# Altium project RF_PCB_REV-B.PrjPcb
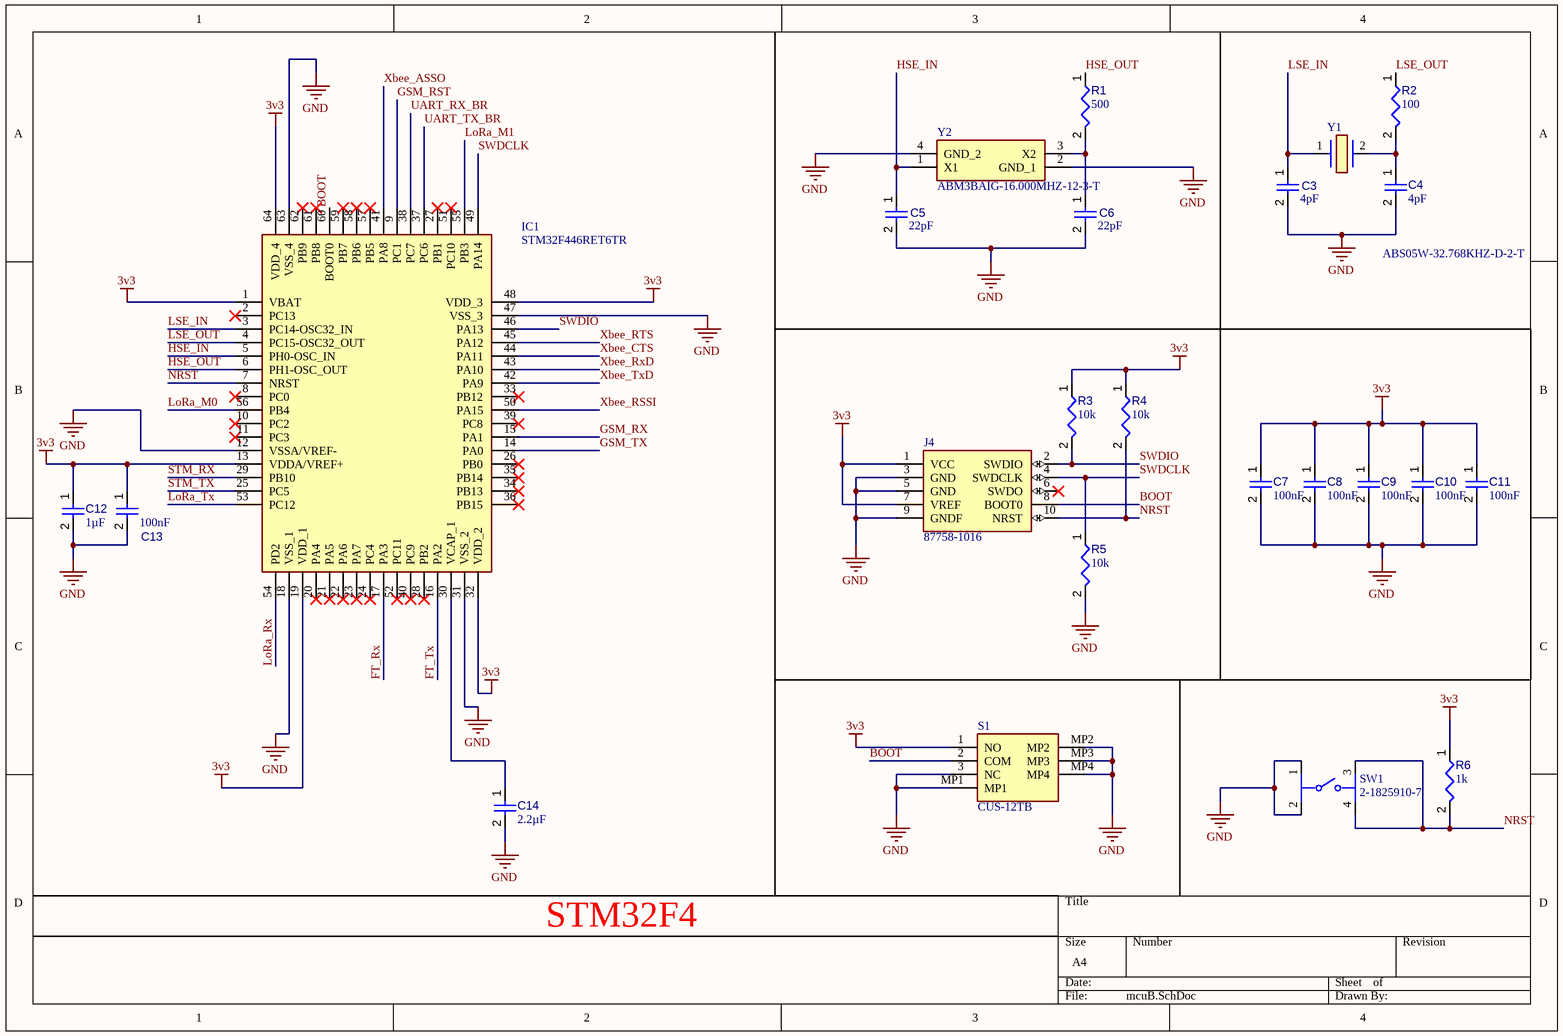
[diagram p0: mcuB.SchDoc]
3 sheets, 55 parts. Net scope: global (net labels, ports and power ports of the same name join across sheets).
Board file: RFPCB_REV-B.PcbDoc
Sheets:
  mcuB.SchDoc
  XbeeB.SchDoc
  LoRaB.SchDoc

## Sheet mcuB.SchDoc
size A4; SheetNumber: 1; SheetTotal: 3

### Parts
C3  value 4pF  [CAPC1608X90X40LL10T20]  (hidden comment: Capacitor 1 uF +/- 10% 25 V 0603)
C4  value 4pF  [CAPC1608X90X40LL10T20]  (hidden comment: Capacitor 1 uF +/- 10% 25 V 0603)
C5  value 22pF  [CAPC1608X90X40LL10T20]  (hidden comment: Capacitor 1 uF +/- 10% 25 V 0603)
C6  value 22pF  [CAPC1608X90X40LL10T20]  (hidden comment: Capacitor 1 uF +/- 10% 25 V 0603)
C7  value 100nF  [CAPC1608X90X40NL10T20]  (hidden comment: Capacitor 100 nF +/-10% 50 V 0603)
C8  value 100nF  [CAPC1608X90X40NL10T20]  (hidden comment: Capacitor 100 nF +/-10% 50 V 0603)
C9  value 100nF  [CAPC1608X90X40NL10T20]  (hidden comment: Capacitor 100 nF +/-10% 50 V 0603)
C10  value 100nF  [CAPC1608X90X40NL10T20]  (hidden comment: Capacitor 100 nF +/-10% 50 V 0603)
C11  value 100nF  [CAPC1608X90X40NL10T20]  (hidden comment: Capacitor 100 nF +/-10% 50 V 0603)
C12  value 1µF  [CAPC2013X135X45NL10T25]  (hidden comment: Capacitor 1 uF +/- 10% 50 V 0805)
C13  value 100nF  [CAPC1608X90X40NL10T20]  (hidden comment: Capacitor 100 nF +/-10% 50 V 0603)
C14  value 2.2µF  [CAPC2013X135X45NL10T25]  (hidden comment: Capacitor 1 uF +/- 10% 50 V 0805)
IC1  STM32F446RET6TR  [QFP50P1200X1200X160-64N]
J4  87758-1016  [HDRV10W75P200_2X5_990X400X595P]
R1  value 500  [RESC1608X55X25ML10T15]  (hidden comment: Resistor 10k +/-1% 0603 100 mW)
R2  value 100  [RESC1608X55X25ML10T15]  (hidden comment: Resistor 10k +/-1% 0603 100 mW)
R3  value 10k  [RESC1608X55X25ML10T15]  (hidden comment: Resistor 10k +/-1% 0603 100 mW)
R4  value 10k  [RESC1608X55X25ML10T15]  (hidden comment: Resistor 10k +/-1% 0603 100 mW)
R5  value 10k  [RESC1608X55X25ML10T15]  (hidden comment: Resistor 10k +/-1% 0603 100 mW)
R6  value 1k  [RESC1608X55X25ML10T15]  (hidden comment: Resistor 10k +/-1% 0603 100 mW)
S1  CUS-12TB  [CUS12TB]
SW1  2-1825910-7  [FP-2-1825910-7-MFG]
Y1  ABS05W-32.768KHZ-D-2-T  [ABS05W32768KHZD2T]
Y2  ABM3BAIG-16.000MHZ-12-3-T  [ABM3BAIG]

### Nets
3v3: C7.1 C8.1 C9.1 C10.1 C11.1 C12.1 C13.1 IC1.1(VBAT) IC1.13(VDDA/VREF+) IC1.19(VDD_1) IC1.32(VDD_2) IC1.48(VDD_3) IC1.64(VDD_4) J4.1(VCC) J4.7(VREF) R3.1 R4.1 R6.1 S1.1(NO)
GND: C3.2 C4.2 C5.2 C6.2 C7.2 C8.2 C9.2 C10.2 C11.2 C12.2 C13.2 C14.2 IC1.12(VSSA/VREF-) IC1.18(VSS_1) IC1.31(VSS_2) IC1.47(VSS_3) IC1.63(VSS_4) J4.3(GND) J4.5(GND) J4.9(GNDF) R5.2 S1.3(NC) S1.MP1 S1.MP2 S1.MP3 S1.MP4 SW1.1 SW1.2 Y2.2(GND_1) Y2.4(GND_2)
BOOT: IC1.60(BOOT0) J4.8(BOOT0) S1.2(COM)
FT_Rx: IC1.17(PA3)
FT_Tx: IC1.16(PA2)
GSM_RST: IC1.9(PC1)
GSM_RX: IC1.15(PA1)
GSM_TX: IC1.14(PA0)
HSE_IN: C5.1 IC1.5(PH0-OSC_IN) Y2.1(X1)
HSE_OUT: IC1.6(PH1-OSC_OUT) R1.1
LoRa_M0: IC1.56(PB4)
LoRa_M1: IC1.55(PB3)
LoRa_Rx: IC1.54(PD2)
LoRa_Tx: IC1.53(PC12)
LSE_IN: C3.1 IC1.3(PC14-OSC32_IN) Y1.1
LSE_OUT: IC1.4(PC15-OSC32_OUT) R2.1
NRST: IC1.7(NRST) J4.10(NRST) R4.2 R6.2 SW1.3 SW1.4
STM_RX: IC1.29(PB10)
STM_TX: IC1.25(PC5)
SWDCLK: IC1.49(PA14) J4.4(SWDCLK) R5.1
SWDIO: IC1.46(PA13) J4.2(SWDIO) R3.2
UART_RX_BR: IC1.38(PC7)
UART_TX_BR: IC1.37(PC6)
Xbee_ASSO: IC1.41(PA8)
Xbee_CTS: IC1.44(PA11)
Xbee_RSSI: IC1.50(PA15)
Xbee_RTS: IC1.45(PA12)
Xbee_RxD: IC1.43(PA10)
Xbee_TxD: IC1.42(PA9)
NetC4_1: C4.1 R2.2 Y1.2
NetC6_1: C6.1 R1.2 Y2.3(X2)
NetC14_1: C14.1 IC1.30(VCAP_1)

Not connected (* = marked no-connect by the designer): IC1 2(PC13)* 8(PC0)* 10(PC2)* 11(PC3)* 20(PA4)* 21(PA5)* 22(PA6)* 23(PA7)* 24(PC4)* 26(PB0)* 27(PB1)* 28(PB2)* 33(PB12)* 34(PB13)* 35(PB14)* 36(PB15)* 39(PC8)* 40(PC9)* 51(PC10)* 52(PC11)* 57(PB5)* 58(PB6)* 59(PB7)* 61(PB8)* 62(PB9)*; J4 6(SWDO)*

### Notes on the sheet
- STM32F4

### Library data of the parts
C3-C6 = CMP-001-00005-6: Chip Capacitor, 1 uF, +/- 10%, 25 V, 0603 (1608 Metric); Capacitor Type: Ceramic; Voltage Rating: 25V; Pins: 2; Mounting Technology: SM; RoHS Compliant: True; Max Operating Temperature: 125°C; Case/Package: 0603; Min Operating Temperature: -55°C; Tolerance: 10%
C7-C11 C13 = CMP-001-00017-6: Chip Capacitor, 100 nF, +/- 10%, 50 V, 0603 (1608 Metric); Voltage Rating: 50V; Capacitor Type: Ceramic; Tolerance: 10%; Mounting Technology: SM; Max Operating Temperature: 125°C; RoHS Compliant: True; Pins: 2; Case/Package: 0603; Min Operating Temperature: -55°C
C12 C14 = CMP-001-00007-6: Chip Capacitor, 1 uF, +/- 10%, 50 V, 0805 (2012 Metric); Capacitor Type: Ceramic; Voltage Rating: 50V; Min Operating Temperature: -55°C; RoHS Compliant: True; Mounting Technology: SM; Case/Package: 0805; Max Operating Temperature: 125°C; Tolerance: 10%; Pins: 2
IC1 = STM32F446RET6TR: Integrated Circuit; Manufacturer_Name: STMicroelectronics; Datasheet Link: https://www.arrow.com/en/products/stm32f446ret6tr/stmicroelectronics; Height: 1.6mm; Manufacturer_Part_Number: STM32F446RET6TR; Mouser Part Number: 511-STM32F446RET6TR; Mouser Price/Stock: https://www.mouser.co.uk/ProductDetail/STMicroelectronics/STM32F446RET6TR?qs=xZ%2FP%252Ba9zWqYaBJrnMqQZtg%3D%3D; Arrow Part Number: STM32F446RET6TR; Arrow Price/Stock: https://www.arrow.com/en/products/stm32f446ret6tr/stmicroelectronics?utm_currency=USD&region=nac
J4 = 87758-1016: Connector; Manufacturer_Name: Molex; Datasheet Link: http://www.molex.com/pdm_docs/sd/877581016_sd.pdf; Height: 5.95mm; Manufacturer_Part_Number: 87758-1016; Mouser Part Number: 538-87758-1016; Mouser Price/Stock: https://www.mouser.co.uk/ProductDetail/Molex/87758-1016?qs=9Wl4wMk6NjrOw5AcqxMewg%3D%3D; Arrow Part Number: 87758-1016; Arrow Price/Stock: https://www.arrow.com/en/products/87758-1016/molex?region=nac
R1-R6 = CMP-009-00017-5: Chip Resistor, 10 KOhm, +/- 1%, 01 W, -55 to 155 degC, 0603 (1608 Metric); Voltage Rating: 50V; Power: 100mW; RoHS Compliant: True; Min Operating Temperature: -55°C; Pins: 2; Case/Package: 0603; Mounting Technology: SM; Max Operating Temperature: 155°C; Tolerance: 1%
S1 = CUS-12TB: Switch; Manufacturer_Name: Nidec Copal; Datasheet Link: https://www.nidec-copal-electronics.com/e/catalog/switch/cus.pdf; Height: 1.4mm; Manufacturer_Part_Number: CUS-12TB; Mouser Part Number: 229-CUS-12TB; Mouser Price/Stock: https://www.mouser.co.uk/ProductDetail/Nidec-Components/CUS-12TB?qs=XeJtXLiO41Q1Ug1dC3Bq%2FQ%3D%3D
SW1 = CMP-03402-000004-1: SWITCH TACTILE SPST-NO 0.05A 24V; Manufacturer: TE Connectivity; Contact Current Rating: 50mA; Operating Force: 160gf; Electromechanical Life: 100000Cycles; Contact Resistance: 100mΩ; ComponentLink2Description: Datasheet; Height: 13.3mm; Digikey Description: SWITCH TACTILE SPST-NO 0.05A 24V; Device Class L2: Switches; Category: Switch; Device Class L3: Pushbutton Switches; Manufacturer Part Number: 2-1825910-7; Device Class L1: Electromechanical; Mount: Through Hole; Temperature Range High: +85°C; ComponentLink2URL: https://www.te.com/commerce/DocumentDelivery/DDEController?Action=showdoc&DocId=Customer+Drawing%7F1825910%7FC10%7Fpdf%7FEnglish%7FENG_CD_1825910_C10.pdf%7F2-1825910-7; RoHS: TRUE; Temperature: -35°C to +85°C; Mouser Description: Switch Tactile OFF (ON) SPST Extended Round Button PC Pins 0.05A 24VDC 100000Cycles 1.57N Thru-Hole Loose; Automotive: No; Voltage Rating Dc: 24V; Package: 2-1825910-7; Lead Free: Yes; Octopart: https://octopart.com/2-1825910-7-te+connectivity-42270510; Temperature Range Low: -35°C; Throw Configuration: SPST-NO
Y1 = ABS05W-32.768KHZ-D-2-T: Crystal or Oscillator; Manufacturer_Name: ABRACON; Datasheet Link: https://abracon.com/Resonators/ABS05W.pdf; Height: 0.5mm; Manufacturer_Part_Number: ABS05W-32.768KHZ-D-2-T; Mouser Part Number: 815-ABS05W32.768KD2T; Mouser Price/Stock: https://www.mouser.co.uk/ProductDetail/ABRACON/ABS05W-32.768KHZ-D-2-T?qs=r5DSvlrkXmJ0aADBg3hvfA%3D%3D; Arrow Part Number: ABS05W-32.768KHZ-D-2-T; Arrow Price/Stock: https://www.arrow.com/en/products/abs05w-32.768khz-d-2-t/abracon?utm_currency=USD&region=nac
Y2 = ABM3BAIG-16.000MHZ-12-3-T: Crystal or Oscillator; Manufacturer_Name: ABRACON; Datasheet Link: https://abracon.com/AIGcrystals/ABM3BAIG.pdf; Height: 0.9mm; Manufacturer_Part_Number: ABM3BAIG-16.000MHZ-12-3-T

## Sheet XbeeB.SchDoc
size A4; SheetNumber: 2; SheetTotal: 3
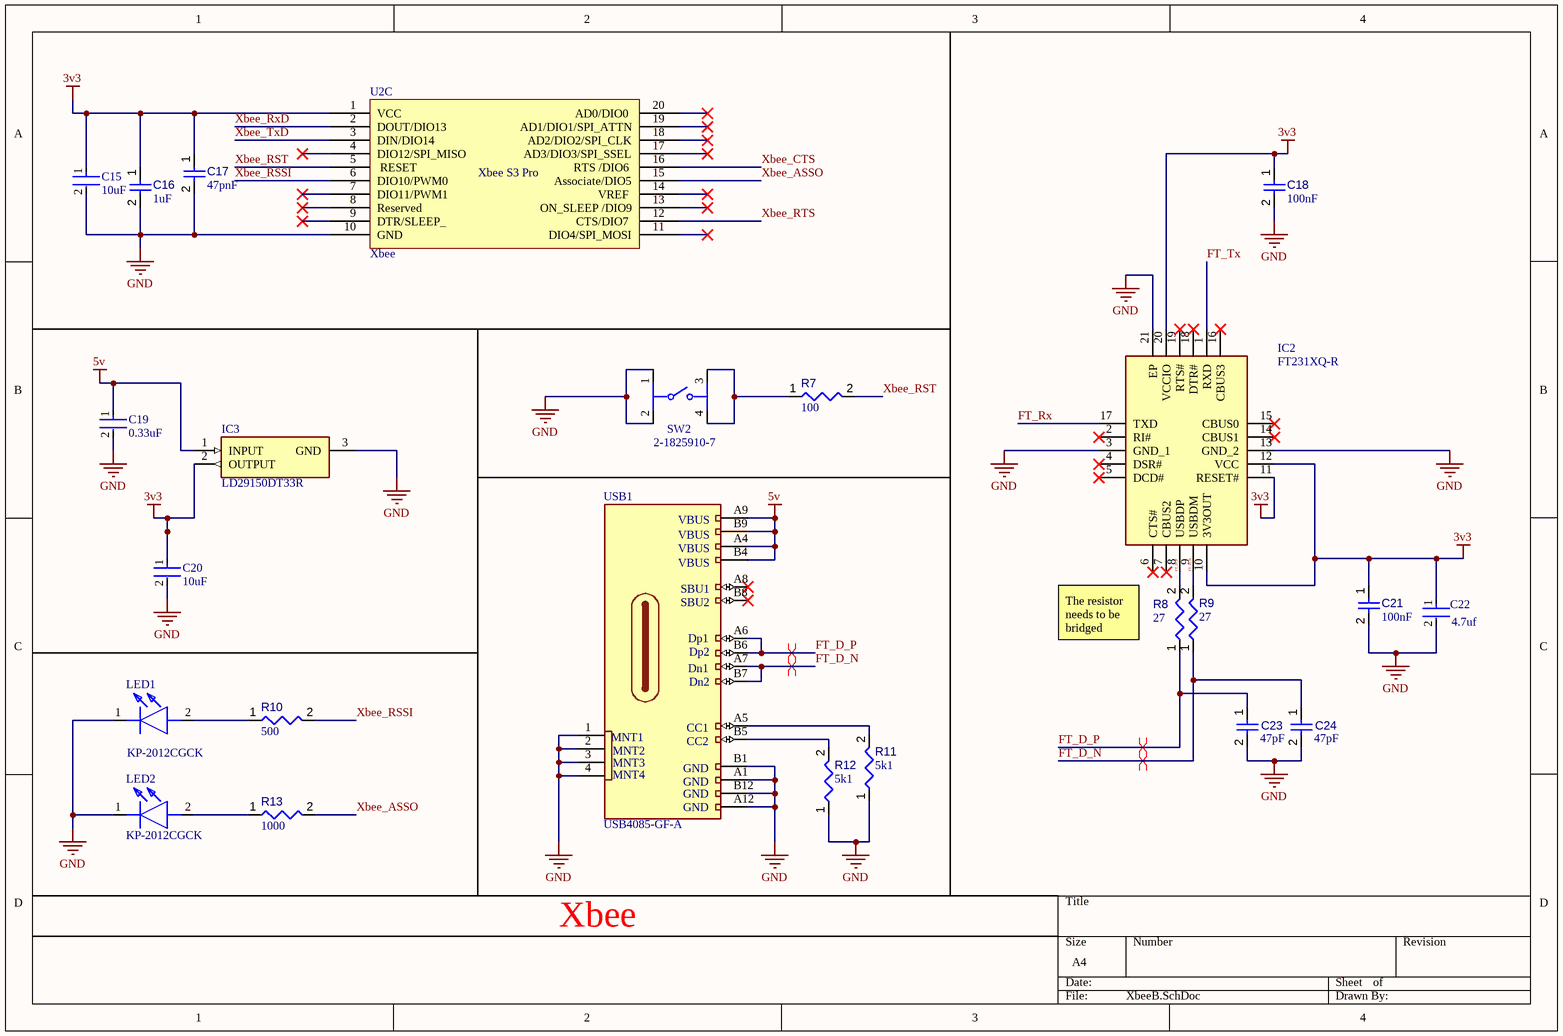
[diagram p1: XbeeB.SchDoc]

### Parts
C15  10uF  [FP-CC1210-GA-MFG]
C16  value 1uF  [CAPC1608X90X40NL10T20]  (hidden comment: Capacitor 100 nF +/-10% 50 V 0603)
C17  value 47pnF  [CAPC1608X90X40NL10T20]  (hidden comment: Capacitor 100 nF +/-10% 50 V 0603)
C18  value 100nF  [CAPC1608X90X40NL10T20]  (hidden comment: Capacitor 100 nF +/-10% 50 V 0603)
C19  0.33uF  [FP-CC1210-GA-MFG]
C20  10uF  [FP-CC1210-GA-MFG]
C21  value 100nF  [CAPC1608X90X40NL10T20]  (hidden comment: Capacitor 100 nF +/-10% 50 V 0603)
C22  4.7uf  [FP-CC0805-0_85-MFG]
C23  value 47pF  [CAPC1608X90X40LL10T20]  (hidden comment: Capacitor 1 uF +/- 10% 25 V 0603)
C24  value 47pF  [CAPC1608X90X40LL10T20]  (hidden comment: Capacitor 1 uF +/- 10% 25 V 0603)
IC2  FT231XQ-R  [QFN50P400X400X80-21N]
IC3  LD29150DT33R  [ST_DPAK_1]
LED1  KP-2012CGCK  [LEDC2012X110N]
LED2  KP-2012CGCK  [LEDC2012X110N]
R7  value 100  [RESC1608X55X25ML10T15]  (hidden comment: Resistor 10k +/-1% 0603 100 mW)
R8  value 27  [RESC1608X55X25ML10T15]  (hidden comment: Resistor 10k +/-1% 0603 100 mW)
R9  value 27  [RESC1608X55X25ML10T15]  (hidden comment: Resistor 10k +/-1% 0603 100 mW)
R10  value 500  [RESC1608X55X25ML10T15]  (hidden comment: Resistor 10k +/-1% 0603 100 mW)
R11  value 5k1  [RESC1608X55X25ML10T15]  (hidden comment: Resistor 10k +/-1% 0603 100 mW)
R12  value 5k1  [RESC1608X55X25ML10T15]  (hidden comment: Resistor 10k +/-1% 0603 100 mW)
R13  value 1000  [RESC1608X55X25ML10T15]  (hidden comment: Resistor 10k +/-1% 0603 100 mW)
SW2  2-1825910-7  [FP-2-1825910-7-MFG]
U2  Xbee  [Xbee]  (part C of 3)
USB1  USB4085-GF-A  [USB4085-GF-A]

### Nets
3v3: C15.1 C16.1 C17.1 C18.1 C20.1 C21.1 C22.1 IC2.10(3V3OUT) IC2.11(RESET#) IC2.12(VCC) IC2.20(VCCIO) IC3.2(OUTPUT) U2.1(VCC)
5v: C19.1 IC3.1(INPUT) USB1.A4(VBUS) USB1.A9(VBUS) USB1.B4(VBUS) USB1.B9(VBUS)
GND: C15.2 C16.2 C17.2 C18.2 C19.2 C20.2 C21.2 C22.2 C23.2 C24.2 IC2.3(GND_1) IC2.13(GND_2) IC2.21(EP) IC3.3(GND) LED1.1(K) LED2.1(K) R11.1 R12.1 SW2.1 SW2.2 U2.10(GND) USB1.1(MNT_1) USB1.2(MNT_2) USB1.3(MNT_3) USB1.4(MNT_4) USB1.A1(GND) USB1.A12(GND) USB1.B1(GND) USB1.B12(GND)
FT_D_N: C24.1 IC2.9(USBDM) R9.1 R9.2 USB1.A7(Dn1) USB1.B7(Dn2)
FT_D_P: C23.1 IC2.8(USBDP) R8.1 R8.2 USB1.A6(Dp1) USB1.B6(Dp2)
FT_Rx: IC2.17(TXD)
FT_Tx: IC2.1(RXD)
Xbee_ASSO: R13.2 U2.15(Associate/DIO5)
Xbee_CTS: U2.16(RTS_/DIO6)
Xbee_RSSI: R10.2 U2.6(DIO10/PWM0)
Xbee_RST: R7.2 U2.5(RESET)
Xbee_RTS: U2.12(CTS/DIO7)
Xbee_RxD: U2.2(DOUT/DIO13)
Xbee_TxD: U2.3(DIN/DIO14)
NetLED1_2: LED1.2(A) R10.1
NetLED2_2: LED2.2(A) R13.1
NetR7_1: R7.1 SW2.3 SW2.4
NetR11_2: R11.2 USB1.A5(CC1)
NetR12_2: R12.2 USB1.B5(CC2)

Not connected (* = marked no-connect by the designer): IC2 2(RI#)* 4(DSR#)* 5(DCD#)* 6(CTS#)* 7(CBUS2)* 14(CBUS1)* 15(CBUS0)* 16(CBUS3)* 18(DTR#)* 19(RTS#)*; U2 4(DIO12/SPI_MISO)* 7(DIO11/PWM1_)* 8(Reserved_)* 9(DTR/SLEEP_)* 11(DIO4/SPI_MOSI)* 13(ON_SLEEP_/DIO9)* 14(VREF_)* 17(AD3/DIO3/SPI_SSEL)* 18(AD2/DIO2/SPI_CLK)* 19(AD1/DIO1/SPI_ATTN)* 20(AD0/DIO0_)*; USB1 A8(SBU1)* B8(SBU2)*

### Layout directives
differential pair: FT_D_N, FT_D_P

### Notes on the sheet
- The resistor needs to be bridged
- Xbee
- (in symbol USB4085-GF-A) MNT1; MNT2; MNT3; MNT4
- (in symbol Xbee, part C) Xbee S3 Pro

### Library data of the parts
C15 C19 C20 = CMP-03422-000918-1: CAP CER 1UF 50V X7R 1210; Manufacturer Part Number: CC1210KKX7R9BB105; Manufacturer: Yageo; Temperature Coefficient: 15%; Material: Ceramic; Tolerance: 10%; RoHS: TRUE; Digikey Description: CAP CER 1UF 50V X7R 1210; Device Class L1: Passive Components; Temperature Range Low: -55°C; Value: 1uF; ComponentLink2Description: Datasheet; Temperature Characteristic: X7R; Capacitance: 1uF; Temperature: -55°C to +125°C; ComponentLink2URL: http://www.yageo.com/documents/recent/UPY-GPHC_X7R_6.3V-to-50V_18.pdf; Lead Free: Yes; Device Class L3: Ceramic Capacitors; Device Class L2: Capacitors; Category: Cap; Temperature Range High: +125°C; Package: CC1210-GA; Mouser Description: 1210 1 uF 50 V ±10 % Tolerance X7R SMT Multilayer Ceramic Capacitor; Octopart: https://octopart.com/cc1210kkx7r9bb105-yageo-22054290; Height: 1.45mm; Voltage Rating: 50V; Ipc Land Pattern Name: CAPC320250X125; Automotive: No; Footprint Url: http://www.yageo.com/exep/pages/download/literatures/UPY-C_GEN_24.pdf
C16-C18 C21 = CMP-001-00017-6: as C7 on sheet mcuB; Tolerance: 10%; Mounting Technology: SM; Max Operating Temperature: 125°C; RoHS Compliant: True; Pins: 2; Case/Package: 0603; Min Operating Temperature: -55°C
C22 = CMP-2100-03606-3: CAP CER 0.1UF 50V X7R 0805; Manufacturer Part Number: CC0805KRX7R9BB104; Manufacturer: Yageo; Tolerance: 0.1; Capacitance: 100 nF; Value: 100 nF; Material: Ceramic; Device Class L1: Passive Components; ComponentLink2Description: Datasheet; Package: CC0805-0.85; Digikey Description: CAP CER 0.1UF 50V X7R 0805; Device Class L3: Ceramic Capacitors; Temperature: -30°C to +85°C; Temperature Characteristic: X7R; Voltage Rating: 50 V; Height: 0.95mm; RoHS: TRUE; Ipc Land Pattern Name: CAPC200125X85; Device Class L2: Capacitors; Category: Cap; Temperature Range Low: -30°C; Temperature Range High: +85°C; Mouser Description: Multilayer Ceramic Capacitors MLCC - SMD/SMT 100nF 50V X7R 10%; Footprint Url: http://www.yageo.com/exep/pages/download/literatures/UPY-C_GEN_24.pdf; Automotive: No; Octopart: https://octopart.com/cc0805krx7r9bb104-yageo-192993; Lead Free: Yes; ComponentLink2URL: http://www.yageo.com/documents/recent/UPY-GPHC_Y5V_6.3V-to-50V_8.pdf
C23 C24 = CMP-001-00005-6: as C3 on sheet mcuB; Pins: 2; Mounting Technology: SM; RoHS Compliant: True; Max Operating Temperature: 125°C; Case/Package: 0603; Min Operating Temperature: -55°C; Tolerance: 10%
IC2 = FT231XQ-R: Integrated Circuit; Manufacturer_Name: FTDI Chip; Datasheet Link: http://www.ftdichip.com/Support/Documents/DataSheets/ICs/DS_FT231X.pdf; Height: 0.8mm; Manufacturer_Part_Number: FT231XQ-R; Mouser Part Number: 895-FT231XQ-R; Mouser Price/Stock: https://www.mouser.co.uk/ProductDetail/FTDI/FT231XQ-R?qs=Gp1Yz1mis3VkAf3iW%252BkumQ%3D%3D; Arrow Part Number: FT231XQ-R; Arrow Price/Stock: https://www.arrow.com/en/products/ft231xq-r/ftdi-chip?region=nac
IC3 = LD29150DT33R: Integrated Circuit; Manufacturer_Name: STMicroelectronics; Datasheet Link: http://www.st.com/web/en/resource/technical/document/datasheet/CD00003403.pdf; Manufacturer_Part_Number: LD29150DT33R; Mouser Part Number: 511-LD29150DT33R; Mouser Price/Stock: https://www.mouser.co.uk/ProductDetail/STMicroelectronics/LD29150DT33R?qs=M4RLcaOHglr1iYLz8rxZ4g%3D%3D; Arrow Part Number: LD29150DT33R; Arrow Price/Stock: https://www.arrow.com/en/products/ld29150dt33r/stmicroelectronics?region=nac
LED1 LED2 = KP-2012CGCK: LED; Manufacturer_Name: Kingbright; Datasheet Link: https://componentsearchengine.com/Datasheets/2/KP-2012CGCK.pdf; Height: 1.1mm; Manufacturer_Part_Number: KP-2012CGCK; Mouser Part Number: N/A; Mouser Price/Stock: https://www.mouser.co.uk/ProductDetail/Kingbright/KP-2012CGCK?qs=2JU0tDl2GZ3tjMUbXin2qw%3D%3D; Arrow Part Number: KP-2012CGCK; Arrow Price/Stock: https://www.arrow.com/en/products/kp-2012cgck/kingbright?utm_currency=USD&region=europe
R7-R13 = CMP-009-00017-5: as R1 on sheet mcuB; RoHS Compliant: True; Min Operating Temperature: -55°C; Pins: 2; Case/Package: 0603; Mounting Technology: SM; Max Operating Temperature: 155°C; Tolerance: 1%
SW2 = CMP-03402-000004-1: as SW1 on sheet mcuB; ComponentLink2Description: Datasheet; Height: 13.3mm; Digikey Description: SWITCH TACTILE SPST-NO 0.05A 24V; Device Class L2: Switches; Category: Switch; Device Class L3: Pushbutton Switches; Manufacturer Part Number: 2-1825910-7; Device Class L1: Electromechanical; Mount: Through Hole; Temperature Range High: +85°C; ComponentLink2URL: https://www.te.com/commerce/DocumentDelivery/DDEController?Action=showdoc&DocId=Customer+Drawing%7F1825910%7FC10%7Fpdf%7FEnglish%7FENG_CD_1825910_C10.pdf%7F2-1825910-7; RoHS: TRUE; Temperature: -35°C to +85°C; Mouser Description: Switch Tactile OFF (ON) SPST Extended Round Button PC Pins 0.05A 24VDC 100000Cycles 1.57N Thru-Hole Loose; Automotive: No; Voltage Rating Dc: 24V; Package: 2-1825910-7; Lead Free: Yes; Octopart: https://octopart.com/2-1825910-7-te+connectivity-42270510; Temperature Range Low: -35°C; Throw Configuration: SPST-NO

## Sheet LoRaB.SchDoc
size A4; SheetNumber: 3; SheetTotal: 3
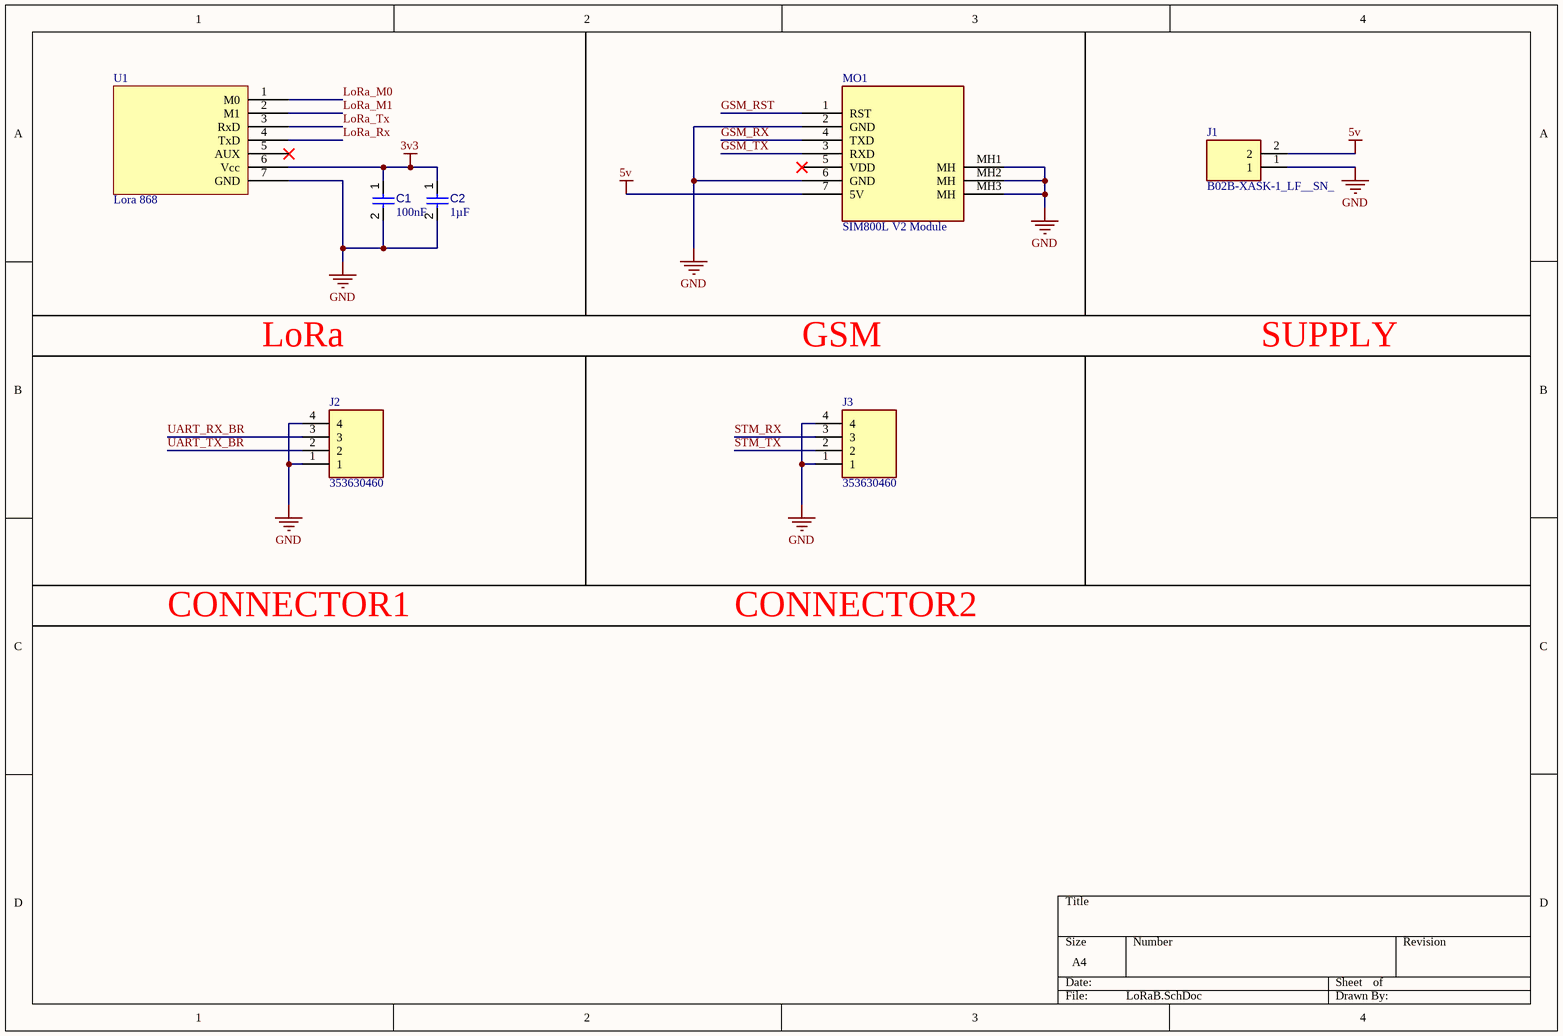
[diagram p2: LoRaB.SchDoc]

### Parts
C1  value 100nF  [CAPC1608X90X40NL10T20]  (hidden comment: Capacitor 100 nF +/-10% 50 V 0603)
C2  value 1µF  [CAPC2013X135X45NL10T25]  (hidden comment: Capacitor 1 uF +/- 10% 50 V 0805)
J1  B02B-XASK-1_LF__SN_  [SHDR2W60P0X250_1X2_750X640X880P]
J2  353630460  [353630460]
J3  353630460  [353630460]
MO1  SIM800L V2 Module  [SIM800LV2.0]
U1  Lora 868  [Lora 833]

### Nets
3v3: C1.1 C2.1 U1.6(Vcc)
5v: J1.2 MO1.7(5V)
GND: C1.2 C2.2 J1.1 J2.1 J2.4 J3.1 J3.4 MO1.2(GND) MO1.6(GND) MO1.MH1(MH) MO1.MH2(MH) MO1.MH3(MH) U1.7(GND)
GSM_RST: MO1.1(RST)
GSM_RX: MO1.4(TXD)
GSM_TX: MO1.3(RXD)
LoRa_M0: U1.1(M0)
LoRa_M1: U1.2(M1)
LoRa_Rx: U1.4(TxD)
LoRa_Tx: U1.3(RxD)
STM_RX: J3.3
STM_TX: J3.2
UART_RX_BR: J2.3
UART_TX_BR: J2.2

Not connected (* = marked no-connect by the designer): MO1 5(VDD)*; U1 5(AUX)*

### Notes on the sheet
- LoRa
- GSM
- SUPPLY
- CONNECTOR1
- CONNECTOR2

### Library data of the parts
C1 = CMP-001-00017-6: as C7 on sheet mcuB; Tolerance: 10%; Mounting Technology: SM; Max Operating Temperature: 125°C; RoHS Compliant: True; Pins: 2; Case/Package: 0603; Min Operating Temperature: -55°C
C2 = CMP-001-00007-6: as C12 on sheet mcuB; Min Operating Temperature: -55°C; RoHS Compliant: True; Mounting Technology: SM; Case/Package: 0805; Max Operating Temperature: 125°C; Tolerance: 10%; Pins: 2
J1 = B02B-XASK-1_LF__SN_: Connector; Manufacturer_Name: JST (JAPAN SOLDERLESS TERMINALS); Manufacturer_Part_Number: B02B-XASK-1(LF)(SN); Datasheet Link: http://www.jst-mfg.com/product/pdf/eng/eXA1.pdf; Height: 8.8mm; Mouser Part Number: N/A; Mouser Price/Stock: https://www.mouser.co.uk/ProductDetail/JST-Commercial/B02B-XASK-1LFSN?qs=IKkN%2F947nfBty2GocXf7QA%3D%3D; Arrow Part Number: B02B-XASK-1(LF)(SN); Arrow Price/Stock: https://www.arrow.com/en/products/b02b-xask-1-lf-sn/jst-manufacturing?utm_currency=USD&region=europe
J2 J3 = 353630460: Connector; Manufacturer_Name: Molex; Datasheet Link: https://www.molex.com/pdm_docs/sd/353630260_sd.pdf; Height: 5.5mm; Manufacturer_Part_Number: 353630460; Arrow Part Number: 353630460; Arrow Price/Stock: https://www.arrow.com/en/products/35363-0460/molex?region=nac
MO1 = SIM800LV2.0: GSM Module
U1 = Lora 833

## Nets that join several sheets
3v3: mcuB (19 pins), XbeeB (13 pins), LoRaB (C1.1 C2.1 U1.6)
5v: XbeeB (6 pins), LoRaB (J1.2 MO1.7)
GND: mcuB (30 pins), XbeeB (29 pins), LoRaB (13 pins)
FT_Rx: mcuB (IC1.17), XbeeB (IC2.17)
FT_Tx: mcuB (IC1.16), XbeeB (IC2.1)
GSM_RST: mcuB (IC1.9), LoRaB (MO1.1)
GSM_RX: mcuB (IC1.15), LoRaB (MO1.4)
GSM_TX: mcuB (IC1.14), LoRaB (MO1.3)
LoRa_M0: mcuB (IC1.56), LoRaB (U1.1)
LoRa_M1: mcuB (IC1.55), LoRaB (U1.2)
LoRa_Rx: mcuB (IC1.54), LoRaB (U1.4)
LoRa_Tx: mcuB (IC1.53), LoRaB (U1.3)
STM_RX: mcuB (IC1.29), LoRaB (J3.3)
STM_TX: mcuB (IC1.25), LoRaB (J3.2)
UART_RX_BR: mcuB (IC1.38), LoRaB (J2.3)
UART_TX_BR: mcuB (IC1.37), LoRaB (J2.2)
Xbee_ASSO: mcuB (IC1.41), XbeeB (R13.2 U2.15)
Xbee_CTS: mcuB (IC1.44), XbeeB (U2.16)
Xbee_RSSI: mcuB (IC1.50), XbeeB (R10.2 U2.6)
Xbee_RTS: mcuB (IC1.45), XbeeB (U2.12)
Xbee_RxD: mcuB (IC1.43), XbeeB (U2.2)
Xbee_TxD: mcuB (IC1.42), XbeeB (U2.3)